# EAGLE design Metronome-v13 (EAGLE 5.04)
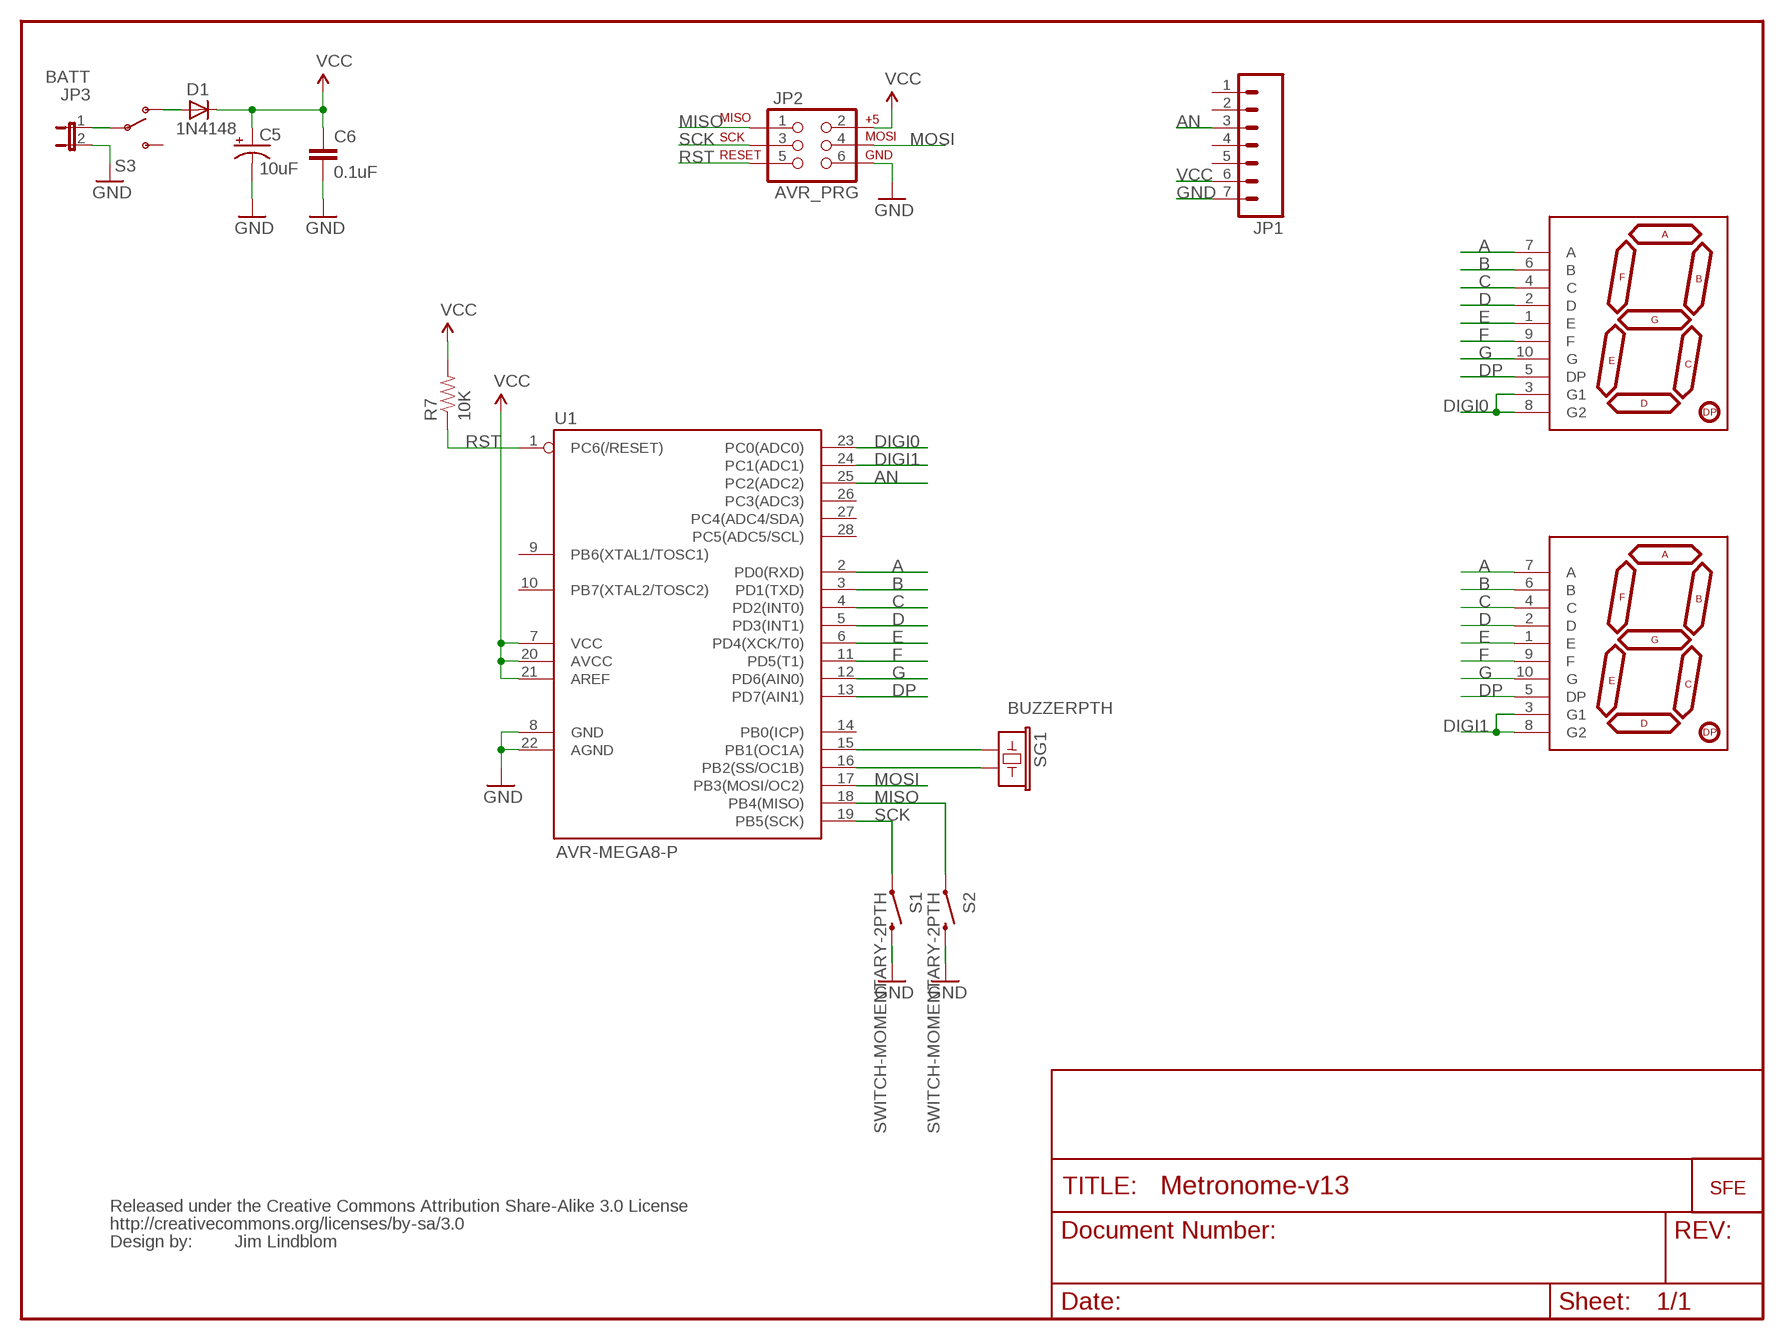
[diagram p0: schematic, sheet 1]

## Parts
C5  10uF  CAP_POLPTH2  [CPOL-RADIAL-10UF-25V]
C6  0.1uF  CAPPTH2  [CAP-PTH-SMALL2]
D1  1N4148  DIODE1N4148  [DIODE-1N4148]
DIGI0  7-SEGMENT-DISPLAY-1"-RED  [7-SEGMENT-1"PTH]
DIGI1  7-SEGMENT-DISPLAY-1"-RED  [7-SEGMENT-1"PTH]
JP1  M07  [1X07]
JP2  AVR_PRG  AVR_SPI_PRG_6PTH  [2X3]
JP3  BATT  JP1E  [1X02]
R7  10K  RESISTORPTH1  [AXIAL-0.3]
S1  SWITCH-MOMENTARY-2PTH  [TACTILE-PTH]
S2  SWITCH-MOMENTARY-2PTH  [TACTILE-PTH]
S3  SWITCH-SPSTPTH_LOCK  [SWITCH-SPDT_LOCK.007S]
SG1  BUZZERPTH  [BUZZER-12MM]
U1  AVR-MEGA8-P  [DIL28-3]
U$1  LOGO-SFENEW  [SFE-NEW-WEBLOGO]
U$2  CREATIVE_COMMONS  [CREATIVE_COMMONS]

## Nets
A: DIGI0.7(A) DIGI1.7(A) U1.2(PD0(RXD))
AN: JP1.3 U1.25(PC2(ADC2))
B: DIGI0.6(B) DIGI1.6(B) U1.3(PD1(TXD))
C: DIGI0.4(C) DIGI1.4(C) U1.4(PD2(INT0))
D: DIGI0.2(D) DIGI1.2(D) U1.5(PD3(INT1))
DIGI0: DIGI0.3(G1) DIGI0.8(G2) U1.23(PC0(ADC0))
DIGI1: DIGI1.3(G1) DIGI1.8(G2) U1.24(PC1(ADC1))
DP: DIGI0.5(DP) DIGI1.5(DP) U1.13(PD7(AIN1))
E: DIGI0.1(E) DIGI1.1(E) U1.6(PD4(XCK/T0))
F: DIGI0.9(F) DIGI1.9(F) U1.11(PD5(T1))
G: DIGI0.10(G) DIGI1.10(G) U1.12(PD6(AIN0))
GND: C5.2(-) C6.2 JP1.7 JP2.6 JP3.2 S1.3 S2.3 U1.8(GND) U1.22(AGND)
MISO: JP2.1 S2.1 U1.18(PB4(MISO))
MOSI: JP2.4 U1.17(PB3(MOSI/OC2))
N$1: JP3.1 S3.2(P)
N$2: D1.A S3.1(O)
N$5: SG1.+ U1.15(PB1(OC1A))
N$6: SG1.- U1.16(PB2(SS/OC1B))
RST: JP2.5 R7.P$1 U1.1(PC6(/RESET))
SCK: JP2.3 S1.1 U1.19(PB5(SCK))
VCC: C5.1(+) C6.1 D1.C JP1.6 JP2.2 R7.P$2 U1.7(VCC) U1.20(AVCC) U1.21(AREF)
Unconnected: JP1.1 JP1.2 JP1.4 JP1.5 S3.3(S) U1.9(PB6(XTAL1/TOSC1)) U1.10(PB7(XTAL2/TOSC2)) U1.14(PB0(ICP)) U1.26(PC3(ADC3)) U1.27(PC4(ADC4/SDA)) U1.28(PC5(ADC5/SCL))

## Notes on the sheet
- Jim Lindblom

## Library data of the parts
C5 = SparkFun:CAP_POL: Capacitor Polarized These are standard SMD and PTH capacitors. Normally 10uF, 47uF, and 100uF in electrolytic and tantalum varieties. Always verify the external diameter of the through hole cap, it varies with capacity, voltage, and manufacturer. The EIA devices should be standard.
C6 = SparkFun:CAP: Capacitor Standard 0603 ceramic capacitor, and 0.1" leaded capacitor.
D1 = SparkFun:DIODE: Diode These are standard reverse protection diodes and small signal diodes. SMA package can handle up to about 1A. SOD-323 can handle about 200mA. What the SOD-323 package when ordering, there are some mfgs out there that are 5-pin packages.
DIGI0 DIGI1 = SparkFun:7-SEGMENT-DISPLAY-1"-RED: 7-Segment Display 1" Red (COM-08546)
JP1 = SparkFun:M07: Header 7 Standard 7-pin 0.1" header. Use with straight break away headers (SKU : PRT-00116), right angle break away headers (PRT-00553), swiss pins (PRT-00743), machine pins (PRT-00117), and female headers (PRT-00115). NOTES ON THE VARIANTS LOCK and LOCK_LONGPADS... This footprint was designed to help hold the alignment of a through-hole component (i.e. 7-pin header) while soldering it into place. You may notice that each hole has been shifted either up or down by 0.005 of an inch from it's more standard position (which is usually a perfectly straight line). This slight alteration caused the pins (the squares in the middle) to touch the edges of the holes. Because they are alternating, it causes a "brace" to hold the header in place. 0.005 has proven to be the perfect amount of "off-center" position when using our standard breakaway headers. Although looks a little odd when you look at the bare footprint, once you have a header in there, the alteration is very hard to notice. Also, if you push a header all the way into place, it is covered up entirely on the bottom side. This idea of altering the position of holes to aid alignment will be further integrated into the Sparkfun Library for other footprints. It can help hold any component with 3 or more connection pins.
JP2 = SparkFun:AVR_SPI_PRG_6: AVR ISP 6 Pin This is the reduced ISP connector for AVR programming. Common on Arduino. This footprint will take up less PCB space and can be used with a 10-pin to 6-pin adapter such as SKU: BOB-08508
JP3 = SparkFun:JP1E: Jumper Basic 0.1" spaced jumper. Use with breakaway headers.
R7 = SparkFun:RESISTOR: Resistor Basic schematic elements and footprints for 0603, 1206, and PTH 1/10th watt (small) resistors.
S1 S2 = SparkFun:SWITCH-MOMENTARY-2
S3 = SparkFun:SWITCH-SPST: SPST Switch Simple slide switch. Spark Fun Electronics SKU : COM-00102
SG1 = SparkFun:BUZZER: Buzzer 12mm Spark Fun Electronics SKU : Comp-Buzzer
U1 = SparkFun:AVR-MEGA8-P: MICROCONTROLLER 8 Kbytes FLASH 1 kbytes SRAM 512 bytes EEPROM USART 4-channel 10 bit ADC 2-channel 8 bit ADC
U$1 = SparkFun:LOGO-SFE: Spark Fun Electronics PCB Logo This is the standard Spark Fun Electronics PCB logo.
U$2 = SparkFun:CREATIVE_COMMONS

## Board
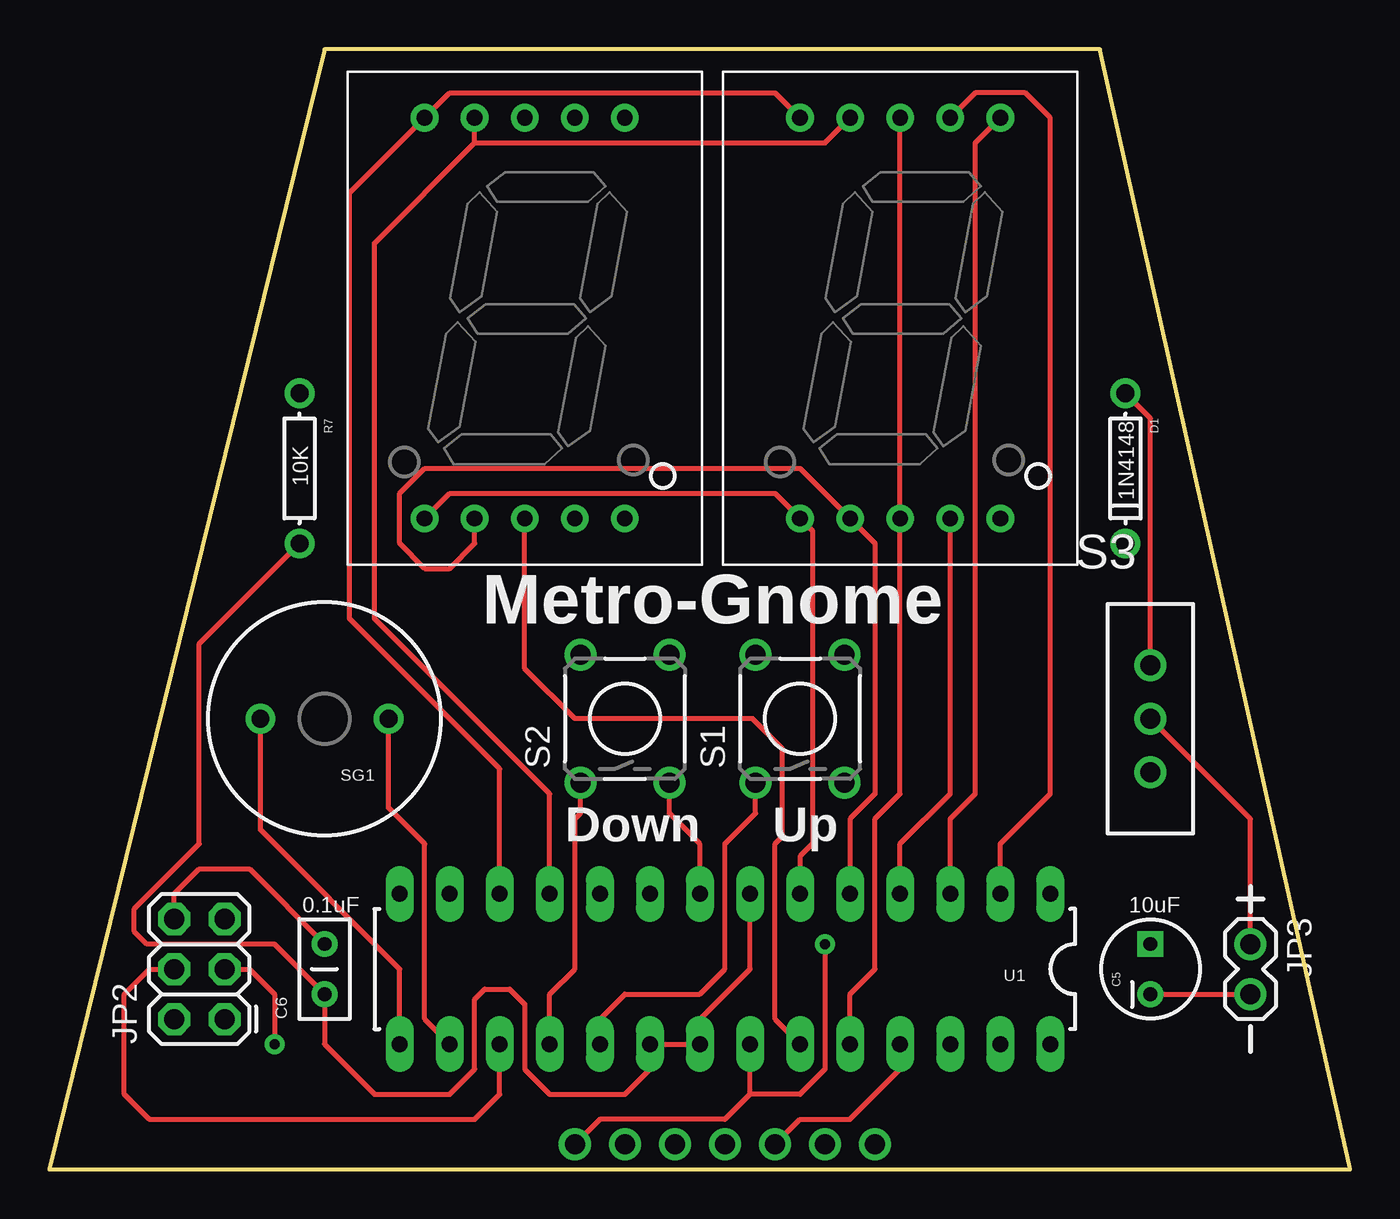
[diagram p1: board, top side]
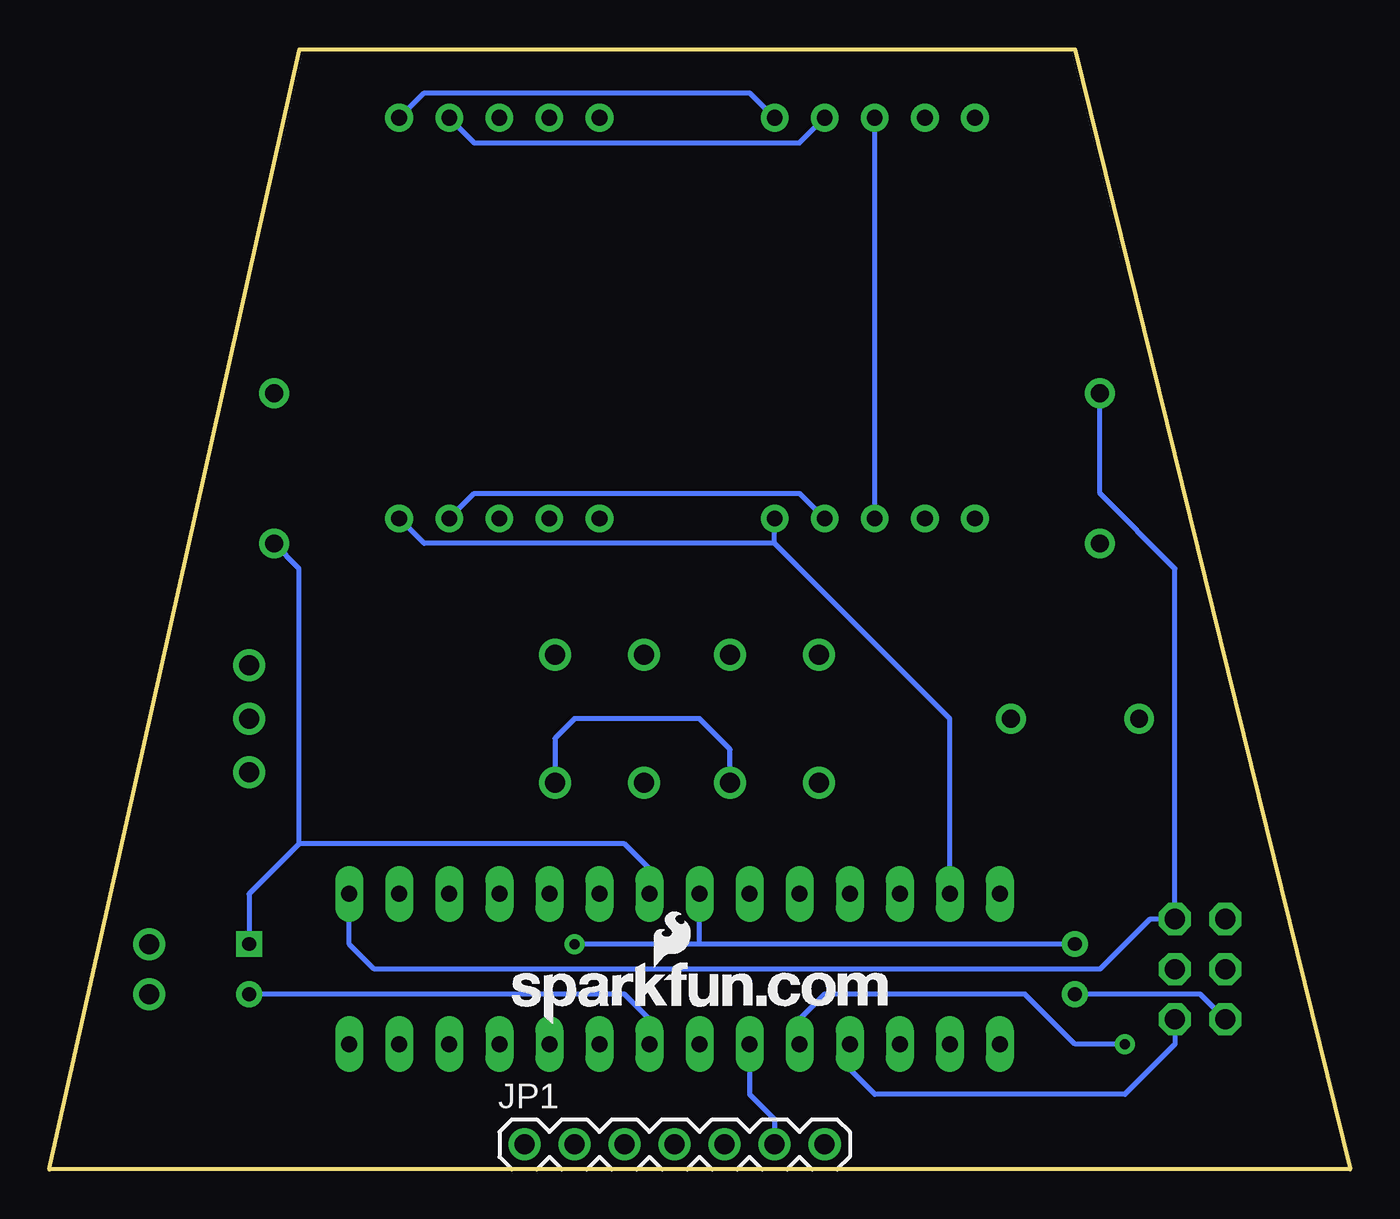
[diagram p2: board, bottom side, seen from below]

Size 66.02 x 56.82 mm. Coordinates in mm from the lower left corner, seen from the top.
Outline: 0,0 66.02,0 53.32,56.82 13.97,56.82 0,0
Copper layers (1*16): Top 0.035mm / dielectric 1.5mm / Bottom 0.035mm
Design rules "SparkFun": minimum track width 8mil, minimum drill 20mil, track to track 8mil, track to pad 8mil, pad to pad 8mil, via to via 8mil, smd to smd 8mil, copper to edge 10mil, drill to drill 8mil, minimum pad ring 12mil, minimum via ring 10mil, stop-mask expansion 4mil, vias tented up to drill 25mil, thermal gap 10mil

### Footprints (pad centres in the part's own frame; a part is rotated, then mirrored left to right if it is on the bottom)
CPOL-RADIAL-10UF-25V = drill 0.7 square: 1 1.27,0 | drill 0.7 round: 2 -1.27,0
CAP-PTH-SMALL2 = drill 0.7 round: 1 0,0; 2 2.54,0
DIODE-1N4148 = drill 0.9 round: A -3.81,0; C 3.81,0
7-SEGMENT-1"PTH = drill 0.8 round: 1 -5.08,-10.16; 2 -2.54,-10.16; 3 0,-10.16; 4 2.54,-10.16; 5 5.08,-10.16; 6 5.08,10.16; 7 2.54,10.16; 8 0,10.16; 9 -2.54,10.16; 10 -5.08,10.16
1X07 = drill 1.016 round: 1 0,0; 2 2.54,0; 3 5.08,0; 4 7.62,0; 5 10.16,0; 6 12.7,0; 7 15.24,0
2X3 = drill 1.016 octagon: 1 0,0; 2 0,2.54; 3 2.54,0; 4 2.54,2.54; 5 5.08,0; 6 5.08,2.54
1X02 = drill 1.016 round: 1 0,0; 2 2.54,0
AXIAL-0.3 = drill 0.9 round: P$1 -3.81,0; P$2 3.81,0
TACTILE-PTH = drill 1.016 round: 1 -3.251,2.261; 2 3.251,2.261; 3 -3.251,-2.261; 4 3.251,-2.261
SWITCH-SPDT_LOCK.007S = drill 1.016 round: 1 0,2.718; 2 0,0; 3 0,-2.718
BUZZER-12MM = drill 0.9 round: + 3.25,0; - -3.25,0
DIL28-3 = drill 0.813 long: 1 -16.51,-3.81; 2 -13.97,-3.81; 3 -11.43,-3.81; 4 -8.89,-3.81; 5 -6.35,-3.81; 6 -3.81,-3.81; 7 -1.27,-3.81; 8 1.27,-3.81; 9 3.81,-3.81; 10 6.35,-3.81; 11 8.89,-3.81; 12 11.43,-3.81; 13 13.97,-3.81; 14 16.51,-3.81; 15 16.51,3.81; 16 13.97,3.81; 17 11.43,3.81; 18 8.89,3.81; 19 6.35,3.81; 20 3.81,3.81; 21 1.27,3.81; 22 -1.27,3.81; 23 -3.81,3.81; 24 -6.35,3.81; 25 -8.89,3.81; 26 -11.43,3.81; 27 -13.97,3.81; 28 -16.51,3.81

### Placement (x,y rotation side)
C5  55.88,10.16 90 top
C6  13.97,8.89 90 top
D1  54.61,35.56 270 top
DIGI0  24.13,43.18 0 top
DIGI1  43.18,43.18 0 top
JP1  41.91,1.27 0 bottom
JP2  8.89,7.62 90 top
JP3  60.96,11.43 270 top
R7  12.7,35.56 270 top
S1  38.1,22.86 90 top
S2  29.21,22.86 90 top
S3  55.88,22.86 0 top
SG1  13.97,22.86 180 top
U1  34.29,10.16 180 top
U$1  42.55,7.37 0 bottom
U$2  21.59,-8.89 0 top  (outside the outline)

### Tracks (layer width: path | path; a pad name or v marks a point on that pad's centre or on a via)
A
  Top 0.254: U1.2 48.26,16.51 50.8,19.05 50.8,34.29 50.8,53.34 49.53,54.61 46.99,54.61 DIGI1.7
  Bottom 0.254: DIGI0.7 27.94,52.07 44.45,52.07 DIGI1.7
AN
  Top 0.254: JP1.3 38.1,2.54 40.64,2.54 43.18,5.08 U1.25
B
  Top 0.254: U1.3 45.72,17.78 46.99,19.05 46.99,52.07 DIGI1.6
  Bottom 0.254: DIGI0.6 30.48,54.61 46.99,54.61 DIGI1.6
C
  Top 0.254: DIGI1.4 45.72,19.05 43.18,16.51 U1.4
  Bottom 0.254: DIGI0.4 27.94,34.29 44.45,34.29 DIGI1.4
D
  Top 0.254: U1.5 40.64,17.78 41.91,19.05 41.91,31.75 DIGI1.2 38.1,35.56 19.05,35.56 17.78,34.29 17.78,31.75 19.05,30.48 20.32,30.48 21.59,31.75 DIGI0.2
DIGI0
  Top 0.254: DIGI0.3 24.13,25.4 26.67,22.86 35.69,22.86 37.21,21.34 37.21,16.89 36.83,16.51 36.83,7.62 U1.23
  Bottom 0.254: DIGI0.3 DIGI0.8
DIGI1
  Top 0.254: DIGI1.8 DIGI1.3 43.18,19.05 41.91,17.78 41.91,10.16 40.64,8.89 U1.24
DP
  Bottom 0.254: DIGI1.5 46.99,31.75 29.21,31.75 | 29.21,31.75 20.32,22.86 U1.13 | 29.21,31.75 DIGI0.5
E
  Top 0.254: DIGI0.1 20.32,34.29 36.83,34.29 DIGI1.1 38.73,32.38 38.73,16.51 38.1,15.88 U1.6
F
  Top 0.254: DIGI1.9 39.37,52.07 21.59,52.07 | U1.11 25.4,19.05 16.51,27.94 16.51,46.99 21.59,52.07 | 21.59,52.07 DIGI0.9
G
  Top 0.254: DIGI1.10 36.83,54.61 20.32,54.61 DIGI0.10 15.24,49.53 15.24,27.94 22.86,20.32 U1.12
GND  (via drill 0.51)
  Top 0.254: JP2.6 6.35,13.97 7.62,15.24 10.16,15.24 C6.2 | C5.2 JP3.2 | S2.3 31.47,18.06 33.02,16.51 U1.8 | v39.37,11.43 39.37,5.08 38.1,3.81 35.56,3.81 | JP1.7 27.94,2.54 34.29,2.54 35.56,3.81 | 35.56,3.81 U1.22
  Bottom 0.254: S2.3 31.47,21.31 33.02,22.86 39.37,22.86 40.36,21.87 S1.3 | C6.2 33.02,11.43 | 33.02,11.43 v39.37,11.43 | 33.02,11.43 U1.8 | C5.2 36.83,8.89 35.56,7.62 U1.22
MISO
  Top 0.254: S2.1 26.95,18.06 26.67,17.78 26.67,10.16 25.4,8.89 U1.18
  Bottom 0.254: JP2.1 8.89,6.35 11.43,3.81 24.13,3.81 25.4,5.08 U1.18
MOSI
  Top 0.254: JP2.4 5.08,10.16 3.81,8.89 3.81,3.81 5.08,2.54 21.59,2.54 22.86,3.81 U1.17
N$1
  Top 0.254: JP3.1 60.96,17.78 S3.2
N$2
  Top 0.254: S3.1 55.88,38.1 D1.A
N$5
  Top 0.254: SG1.+ 10.72,17.22 17.78,10.16 U1.15
N$6
  Top 0.254: SG1.- 17.22,18.34 19.05,16.51 19.05,7.62 U1.16
RST
  Bottom 0.254: R7.P$1 12.7,34.29 8.89,30.48 JP2.5 10.16,12.7 12.7,10.16 49.53,10.16 50.8,11.43 U1.1
SCK  (via drill 0.51)
  Top 0.254: S1.1 35.84,18.06 34.29,16.51 34.29,10.16 33.02,8.89 29.21,8.89 27.94,7.62 U1.19 | JP2.3 10.16,10.16 11.43,8.89 v11.43,6.35
  Bottom 0.254: v11.43,6.35 13.97,6.35 16.51,8.89 26.67,8.89 27.94,7.62 U1.19
VCC
  Top 0.254: U1.7 35.56,10.16 33.02,7.62 U1.21 U1.20 30.48,5.08 29.21,3.81 25.4,3.81 24.13,5.08 24.13,8.38 23.37,9.14 22.1,9.14 21.59,8.64 21.59,5.08 20.32,3.81 16.51,3.81 13.97,6.35 C6.1 11.43,11.43 4.95,11.43 4.32,12.06 4.32,13.21 7.62,16.51 7.62,26.67 R7.P$2
  Bottom 0.254: JP2.2 7.62,8.89 C6.1 | D1.C 53.34,30.48 53.34,16.51 | U1.7 35.56,15.24 36.83,16.51 53.34,16.51 | JP1.6 29.21,2.54 30.48,3.81 U1.20 | 53.34,16.51 55.88,13.97 C5.1

### Text on the board
tPlace: Metro-Gnome | Down | Up